# EasyEDA Pro project EasyEDAPro-Schematic.epro, schematic iButton
Create Date: 2024-01-23; Page Name: P1; Project Name: flipper; Schematic Name: iButton; Update Date: 2024-01-24; Company: 嘉立创EDA; Page Size: A4; Version: V1.0
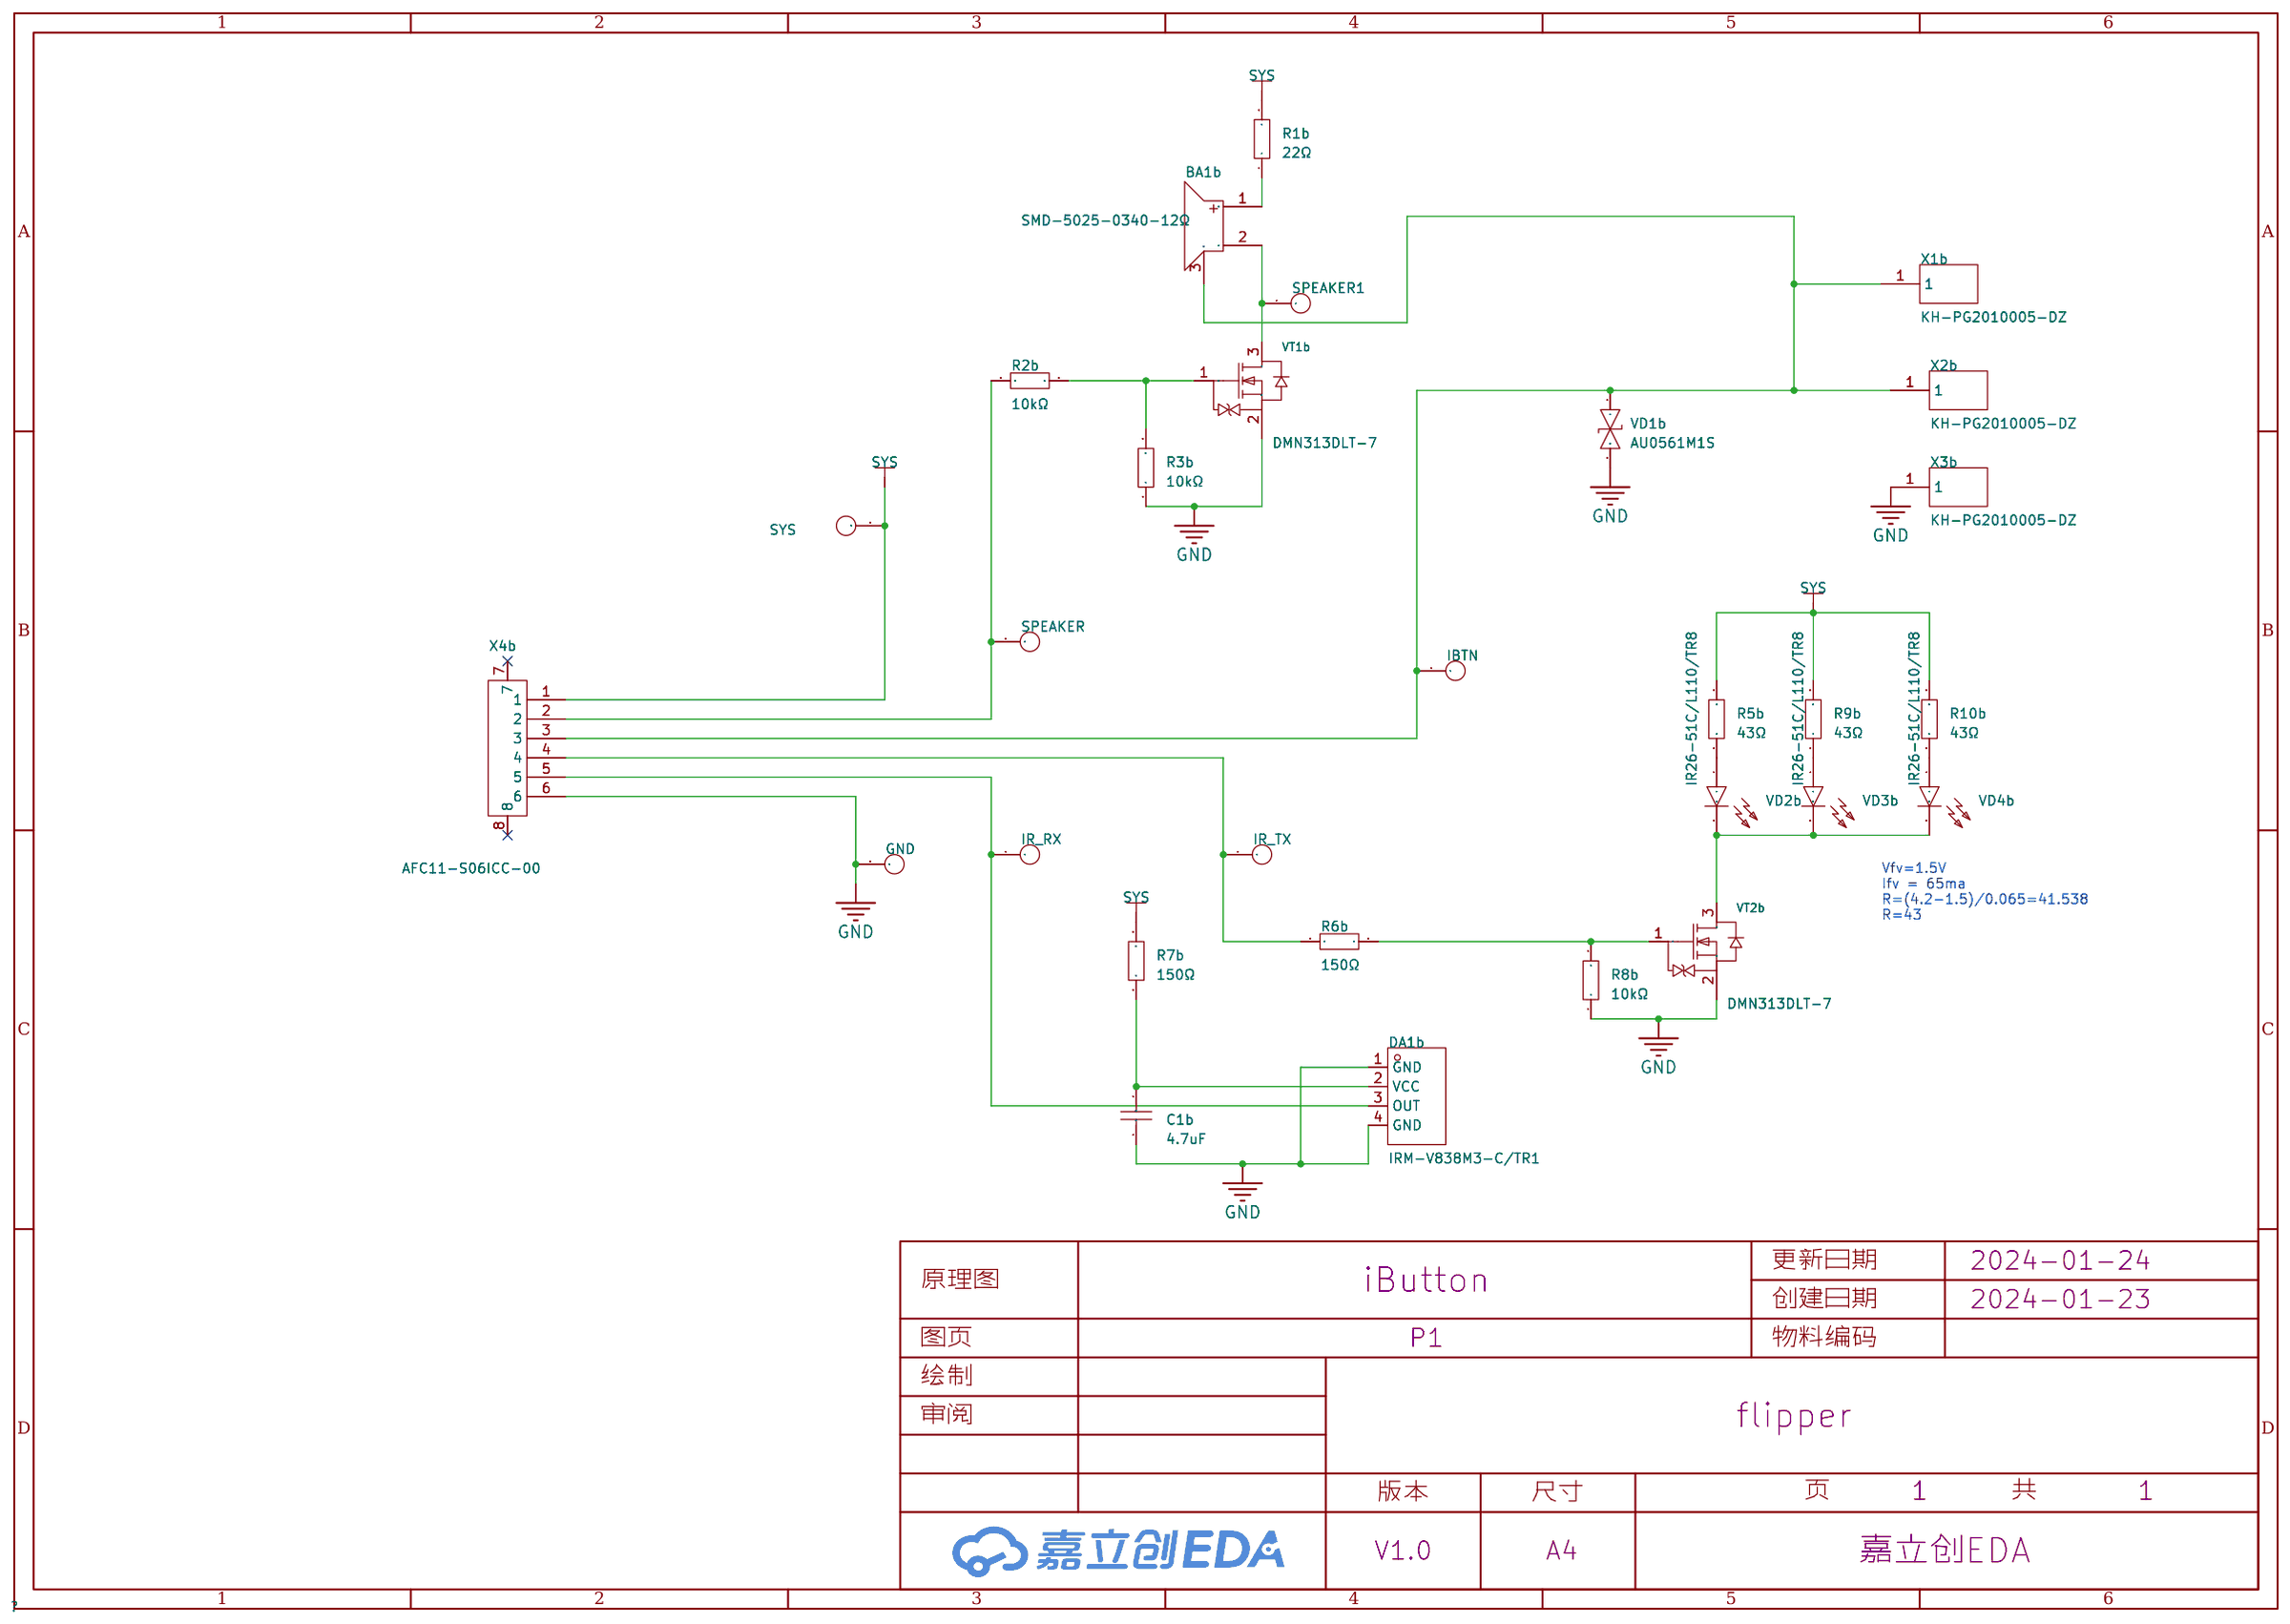
[diagram p7: schematic sheet]

## Parts
BA1b  SMD-5025-0340-12Ω  [BUZ-SMD_3P-L5.0-W5.0-BL]
C1b  4.7uF  [C0402]
DA1b  IRM-V838M3-C/TR1  [OPTO-SMD_IRM-V838M3-C-TR1]
GND  -  [测试点0.8mm]
IBTN  -  [测试点0.8mm]
IR_RX  -  [测试点0.8mm]
IR_TX  -  [测试点0.8mm]
R1b  22Ω  [R0402]
R2b  10kΩ  [R0402]
R3b  10kΩ  [R0402]
R5b  43Ω  [R0402]
R6b  150Ω  [R0402]
R7b  150Ω  [R0402]
R8b  10kΩ  [R0402]
R9b  43Ω  [R0402]
R10b  43Ω  [R0402]
SPEAKER  -  [测试点0.8mm]
SPEAKER1  -  [测试点0.8mm]
SYS  -  [测试点0.8mm]
VD1b  AU0561M1S  [D0402-BI]
VD2b  IR26-51C/L110/TR8  [OPTO-SMD_L3.0-W2.6_IR26-51C-L110-TR8]
VD3b  IR26-51C/L110/TR8  [OPTO-SMD_L3.0-W2.6_IR26-51C-L110-TR8]
VD4b  IR26-51C/L110/TR8  [OPTO-SMD_L3.0-W2.6_IR26-51C-L110-TR8]
VT1b  DMN313DLT-7  [SOT-523-3_L1.6-W0.8-P1.00-LS1.6-BR]
VT2b  DMN313DLT-7  [SOT-523-3_L1.6-W0.8-P1.00-LS1.6-BR]
X1b  KH-PG2010005-DZ  [SMD-1_BD2.0-H10.0]
X2b  KH-PG2010005-DZ  [SMD-1_BD2.0-H10.0]
X3b  KH-PG2010005-DZ  [SMD-1_BD2.0-H10.0]
X4b  AFC11-S06ICC-00  [FPC-SMD_6P-P0.50_AFC11-S06ICC-00]

## Library data of the parts
BA1b = SMD-5025-0340-12Ω: LCSC Part Name: 贴片无源蜂鸣器; Supplier Part: C2693575; Manufacturer: S&S(海旭); Supplier Footprint: SMD,5x5mm; JLCPCB Part Class: 扩展库; Datasheet: https://atta.szlcsc.com/upload/public/pdf/source/20210304/C2693575_C016F81F20CF44788ED1674423B845A2.pdf; Supplier: LCSC
C1b = CL05A475KP5NRNC: 容值:4.7uF;精度:±10%;额定电压:10V;材质(温度系数):X5R;; LCSC Part Name: 4.7uF ±10% 10V; Supplier Part: C368809; Manufacturer: SAMSUNG(三星); Supplier Footprint: 0402; JLCPCB Part Class: Extended Part; Datasheet: https://atta.szlcsc.com/upload/public/pdf/source/20160218/1457707763339.pdf; Supplier: LCSC; Tolerance: ±10%; Voltage Rated: 10V; Temperature Coefficient: X5R
DA1b = IRM-V838M3-C/TR1: Supplier Part: C3291489; Manufacturer: EVERLIGHT(亿光); Supplier Footprint: SMD-4P,3x6.6mm; JLCPCB Part Class: 扩展库; Datasheet: https://atta.szlcsc.com/upload/public/pdf/source/20220701/F9BEE807C545A93DDFC61CA88052E198.pdf; Supplier: LCSC
GND IBTN IR_RX IR_TX SPEAKER SPEAKER1 SYS = 测试点: Check: false
R1b = 0402WGF220JTCE: 阻值:22Ω;精度:±1%;功率:62.5mW;温度系数:±100ppm/℃;电阻类型:厚膜电阻;; LCSC Part Name: 22Ω ±1% 62.5mW 厚膜电阻; Supplier Part: C25092; Manufacturer: UNI-ROYAL(厚声); Supplier Footprint: 0402; JLCPCB Part Class: Basic Part; Datasheet: https://atta.szlcsc.com/upload/public/pdf/source/20200306/C422600_1E6D84923E4A46A82E41ADD87F860B5C.pdf; Supplier: LCSC; Tolerance: ±1%; Power(Watts): 62.5mW; Overload Voltage (Max): 50V; Temperature Coefficient: ±100ppm/℃; Type: 厚膜电阻; Operating Temperature Range: -55℃~+155℃
R2b R3b R8b = RC0402FR-0710KL: 电阻类型:厚膜电阻;阻值:10kΩ;精度:±1%;功率:62.5mW;; LCSC Part Name: 10kΩ ±1% 62.5mW; Supplier Part: C60490; Manufacturer: YAGEO(国巨); Supplier Footprint: 0402; JLCPCB Part Class: Extended Part; Datasheet: https://atta.szlcsc.com/upload/public/pdf/source/20170606/1496716515432.pdf; Supplier: LCSC; Type: 厚膜电阻; Tolerance: ±1%; Power(Watts): 62.5mW; Temperature Coefficient: ±100ppm/℃; Overload Voltage (Max): 50V; Operating Temperature Range: -55℃~+155℃
R5b R9b R10b = RK73B1ETTP430J: 电阻类型:厚膜电阻;阻值:43Ω;精度:±5%;功率:100mW;; LCSC Part Name: 厚膜电阻 43Ω ±5% 100mW; Supplier Part: C131584; Manufacturer: KOA; Supplier Footprint: 0402; JLCPCB Part Class: 扩展库; Datasheet: https://atta.szlcsc.com/upload/public/pdf/source/20170918/C131584_1505727002382976427.pdf; Supplier: LCSC; Type: 厚膜电阻; Tolerance: ±5%; Power(Watts): 100mW; Temperature Coefficient: ±200ppm/℃; Overload Voltage (Max): 50V; Operating Temperature Range: -55℃~+155℃
R6b R7b = 0402WGF1500TCE: 阻值:150Ω;精度:±1%;功率:62.5mW;温度系数:±100ppm/℃;电阻类型:厚膜电阻;; LCSC Part Name: 150Ω ±1% 62.5mW 厚膜电阻; Supplier Part: C25082; Manufacturer: UNI-ROYAL(厚声); Supplier Footprint: 0402; JLCPCB Part Class: Basic Part; Datasheet: https://atta.szlcsc.com/upload/public/pdf/source/20200306/C422600_1E6D84923E4A46A82E41ADD87F860B5C.pdf; Supplier: LCSC; Tolerance: ±1%; Power(Watts): 62.5mW; Overload Voltage (Max): 50V; Temperature Coefficient: ±100ppm/℃; Type: 厚膜电阻; Operating Temperature Range: -55℃~+155℃
VD1b = AU0561M1S: 反向截止电压(Vrwm):5V@Max;最大钳位电压:10V;峰值脉冲电流(Ipp)@10/1000us:-;峰值脉冲功率(Ppp)@10/1000us:-;击穿电压:6V;; LCSC Part Name: 双向TVS 5V截止; Supplier Part: C3002761; Manufacturer: Applied Power(应能微); Supplier Footprint: 0402; JLCPCB Part Class: 扩展库; Datasheet: https://atta.szlcsc.com/upload/public/pdf/source/20220507/27E0F5E1FB204E6E73732074B4278B9F.pdf; Supplier: LCSC; Reverse Stand-Off Voltage (Vrwm): 5V@Max; Maximum Clamping Voltage: 10V; Breakdown Voltage: 6V; Reverse Leakage Current (Ir): 200nA; Type: TVS
VD2b VD3b VD4b = IR26-51C/L110/TR8: 辐射强度:-;; LCSC Part Name: IR26-51C/L110/TR8 侧贴; Supplier Part: C55975; Manufacturer: EVERLIGHT(亿光); Supplier Footprint: SMD,2.6x3mm; JLCPCB Part Class: 扩展库; Datasheet: https://atta.szlcsc.com/upload/public/pdf/source/20150821/1457707348000.pdf; Supplier: LCSC
VT1b VT2b = DMN313DLT-7: 类型:N沟道;漏源电压(Vdss):30V;连续漏极电流(Id):270mA;功率(Pd):280mW;导通电阻(RDS(on)@Vgs,Id):2Ω@4V,10mA;; LCSC Part Name: N沟道 耐压:30V 电流:270mA; Supplier Part: C155524; Manufacturer: DIODES(美台); Supplier Footprint: SOT-523-3; JLCPCB Part Class: 扩展库; Datasheet: https://atta.szlcsc.com/upload/public/pdf/source/20180307/C155524_15204109726361407920.pdf; Supplier: LCSC; Type: N沟道; Drain Source Voltage (Vdss): 30V; Continuous Drain Current (Id): 270mA; Power Dissipation (Pd): 280mW; Drain Source On Resistance (RDS(on)@Vgs,Id): 2Ω@4V,10mA; Gate Threshold Voltage (Vgs(th)@Id): 1.5V@250uA; Total Gate Charge (Qg@Vgs): 500pC@4.5V; Input Capacitance (Ciss@Vds): 36.3pF@5V; Operating Temperature: -55℃~+150℃@(Tj)
X1b X2b X3b = KH-PG2010005-DZ: 类型:弹簧顶针(POGO PIN);PIN位数:单PIN位;全长/全高:10mm;额定电流:1A;额定电压:12V;触头材质:黄铜;触头镀层:金;; LCSC Part Name: 顶针; Supplier Part: C2842933; Manufacturer: kinghelm(金航标); JLCPCB Part Class: 扩展库; Datasheet: https://atta.szlcsc.com/upload/public/pdf/source/20210628/C2842933_2FC659C9E4B13E1F46CE59B211E521AD.pdf; Supplier: LCSC; Type: 弹簧顶针(POGO PIN); Number of Pins: 单PIN位; Overall Length/Height: 10mm; Rated Current: 1A; Rated Voltage: 12V; Contact Material: 黄铜; Contact Plating: 金
X4b = AFC11-S06ICC-00: 锁定特性:抽屉式;触点类型:单侧触点/垂直;触点数量:6P;间距:0.5mm;安装类型:立贴;; Supplier: LCSC; Supplier Part: C11066; Manufacturer: JS(钜硕电子); JLCPCB Part Class: 扩展库; LCSC Part Name: 间距:0.5mm P数:6P 抽屉式 单侧触点/垂直; Supplier Footprint: SMD,P=0.5mm; Datasheet: https://atta.szlcsc.com/upload/public/pdf/source/20191211/C466537_F6F2472ADACFFA77E875AFE9DAB8E0AD.pdf; Locking Feature: 抽屉式; Contact Type: 单侧触点/垂直; Number of Contacts: 6P; Pitch: 0.5mm; Mounting Type: 立贴; FFC, FCB Thickness: 0.3mm; Height Above Board: 4.4mm

## Nets
GND: C1b.1 DA1b.1(GND) DA1b.4(GND) GND.1 R3b.1 R8b.1 VD1b.2 VT1b.2(S) VT2b.2(S) X3b.1 X4b.6
SYS: R1b.2 R5b.2 R7b.2 R9b.2 R10b.2 SYS.1 X4b.1
$1N343: R2b.1 SPEAKER.1 X4b.2
$1N565: R2b.2 R3b.2 VT1b.1(G)
$1N1085: IR_TX.1 R6b.1 X4b.4
$1N1228: R6b.2 R8b.2 VT2b.1(G)
$1N1390: VD2b.2(C) VD3b.2(C) VD4b.2(C) VT2b.3(D)
$1N1470: R5b.1 VD2b.1(A)
$1N1509: R9b.1 VD3b.1(A)
$1N1548: R10b.1 VD4b.1(A)
$1N1606: DA1b.3(OUT) IR_RX.1 X4b.5
$1N1617: C1b.2 DA1b.2(VCC) R7b.1
$1N2115: BA1b.1 R1b.1
$1N2118: BA1b.2 SPEAKER1.1 VT1b.3(D)
$1N2122: BA1b.3 IBTN.1 VD1b.1 X1b.1 X2b.1 X4b.3

Not connected (* = marked no-connect by the designer): X4b 7* 8*

## Notes on the sheet
- Vfv=1.5V
  Ifv = 65ma
  R=(4.2-1.5)/0.065=41.538
  R=43
